# EAGLE schematic ee242a-lab4-amp -values2 (EAGLE 9.0.1)
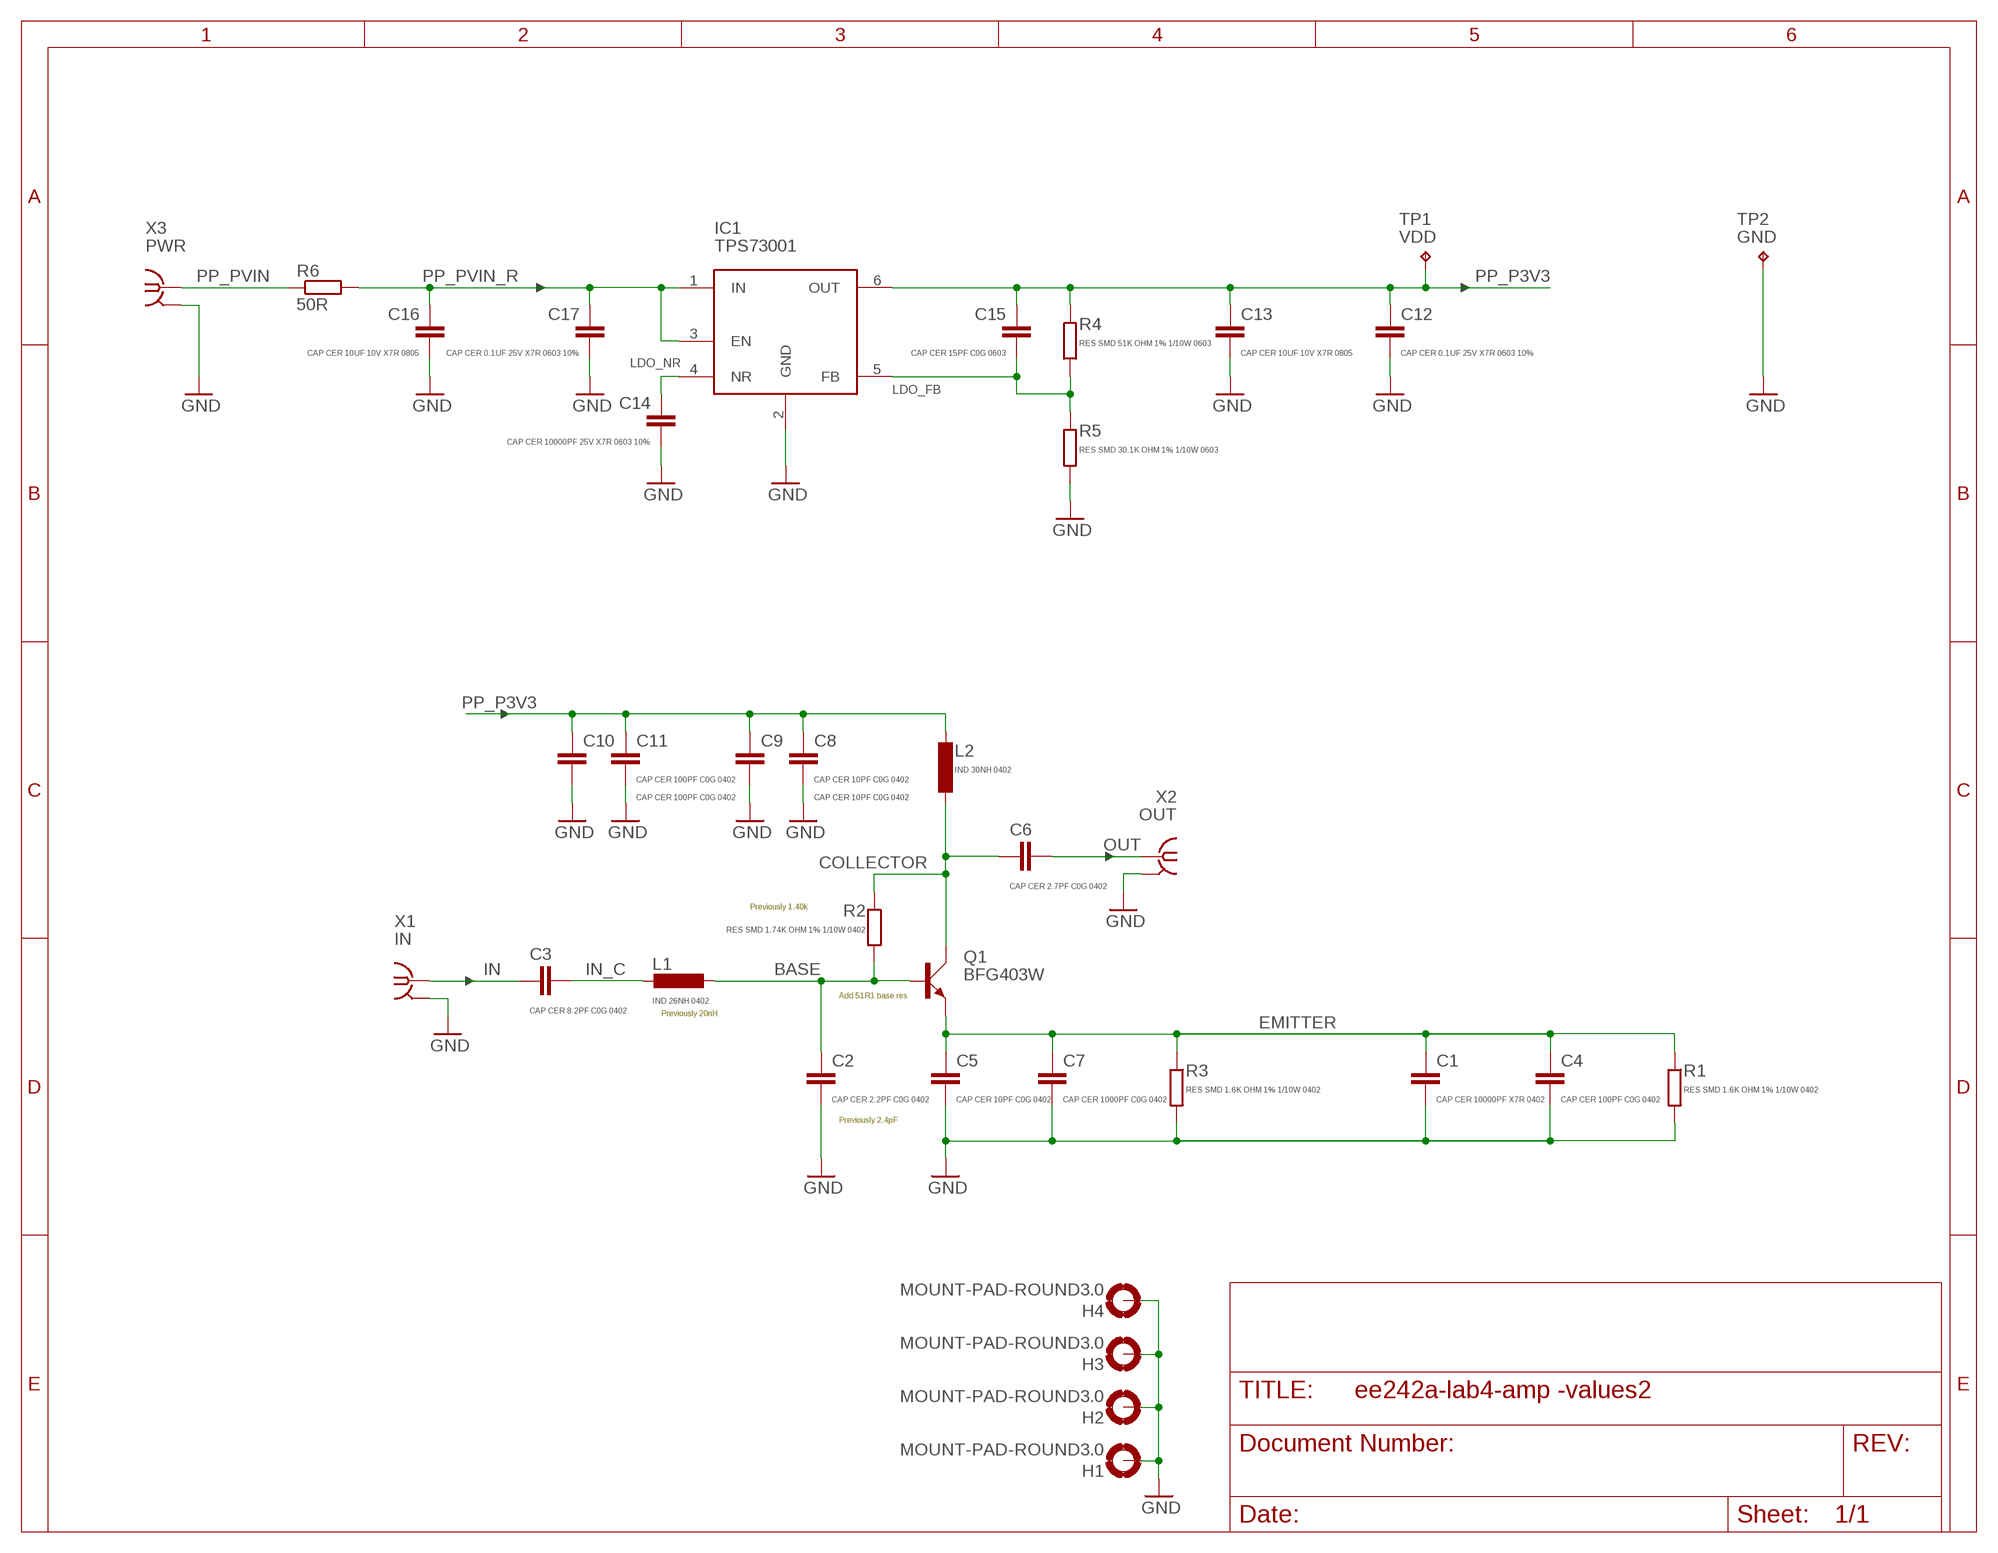
[diagram p0: schematic, sheet 1]

## Parts
C1  CAP CER 10000PF X7R 0402  C-EUC0402  [C0402]
C2  CAP CER 2.2PF C0G 0402  C-EUC0402  [C0402]
C3  CAP CER 8.2PF C0G 0402  C-EUC0402  [C0402]
C4  CAP CER 100PF C0G 0402  C-EUC0402  [C0402]
C5  CAP CER 10PF C0G 0402  C-EUC0402  [C0402]
C6  CAP CER 2.7PF C0G 0402  C-EUC0402  [C0402]
C7  CAP CER 1000PF C0G 0402  C-EUC0402  [C0402]
C8  CAP CER 10PF C0G 0402  C-EUC0402  [C0402]
C9  CAP CER 10PF C0G 0402  C-EUC0402  [C0402]
C10  CAP CER 100PF C0G 0402  C-EUC0402  [C0402]
C11  CAP CER 100PF C0G 0402  C-EUC0402  [C0402]
C12  CAP CER 0.1UF 25V X7R 0603 10%  C-EUC0603  [C0603]
C13  CAP CER 10UF 10V X7R 0805  C-EUC0805  [C0805]
C14  CAP CER 10000PF 25V X7R 0603 10%  C-EUC0603  [C0603]
C15  CAP CER 15PF C0G 0603  C-EUC0603  [C0603]
C16  CAP CER 10UF 10V X7R 0805  C-EUC0805  [C0805]
C17  CAP CER 0.1UF 25V X7R 0603 10%  C-EUC0603  [C0603]
H1  MOUNT-PAD-ROUND3.0  [3,0-PAD]
H2  MOUNT-PAD-ROUND3.0  [3,0-PAD]
H3  MOUNT-PAD-ROUND3.0  [3,0-PAD]
H4  MOUNT-PAD-ROUND3.0  [3,0-PAD]
IC1  TPS73001  [SOT23-6L]
L1  IND 26NH 0402  L-EU0402  [R0402]
L2  IND 30NH 0402  L-EU0402  [R0402]
Q1  BFG403W  [SOT343R]
R1  RES SMD 1.6K OHM 1% 1/10W 0402  R-EU_R0402  [R0402]
R2  RES SMD 1.74K OHM 1% 1/10W 0402  R-EU_R0402  [R0402]
R3  RES SMD 1.6K OHM 1% 1/10W 0402  R-EU_R0402  [R0402]
R4  RES SMD 51K OHM 1% 1/10W 0603  R-EU_R0603  [R0603]
R5  RES SMD 30.1K OHM 1% 1/10W 0603  R-EU_R0603  [R0603]
R6  50R  R-EU_R0805  [R0805]
TP1  VDD  KEYSTONE_5000  [KEYSTONE_5000_MINIATURE]
TP2  GND  KEYSTONE_5000  [KEYSTONE_5000_MINIATURE]
X1  IN  SMA-142-0701-881/886  [J502-ND-142-0701-881/886]
X2  OUT  SMA-142-0701-881/886  [J502-ND-142-0701-881/886]
X3  PWR  SMA-142-0701-881/886  [J502-ND-142-0701-881/886]

## Nets
BASE: C2.1 L1.2 Q1.2(B) R2.2
COLLECTOR: C6.1 L2.2 Q1.4(C) R2.1
EMITTER: C1.1 C4.1 C5.1 C7.1 Q1.1(E) Q1.3(E) R1.1 R3.1
GND: C1.2 C2.2 C4.2 C5.2 C7.2 C8.2 C9.2 C10.2 C11.2 C12.2 C13.2 C14.2 C16.2 C17.2 H1.B3,0(MOUNT) H2.B3,0(MOUNT) H3.B3,0(MOUNT) H4.B3,0(MOUNT) IC1.2(GND) R1.2 R3.2 R5.2 TP2.P$1 X1.G@1(GND) X2.G@1(GND) X3.G@1(GND)
IN: C3.1 X1.1
IN_C: C3.2 L1.1
LDO_FB: C15.2 IC1.5(FB) R4.1 R5.1
LDO_NR: C14.1 IC1.4(NR)
OUT: C6.2 X2.1
PP_P3V3: C8.1 C9.1 C10.1 C11.1 C12.1 C13.1 C15.1 IC1.6(OUT) L2.1 R4.2 TP1.P$1
PP_PVIN: R6.1 X3.1
PP_PVIN_R: C16.1 C17.1 IC1.1(IN) IC1.3(EN) R6.2

## Notes on the sheet
- Previously 1.40k
- Add 51R1 base res
- Previously 20nH
- Previously 2.4pF

## Power pins joined to a net without a drawn wire
GND: X1.G@2(GND) X1.G@3(GND) X1.G@4(GND) X2.G@2(GND) X2.G@3(GND) X2.G@4(GND) X3.G@2(GND) X3.G@3(GND) X3.G@4(GND)

## Library data of the parts
C1-C12 C14 C15 C17 = rcl-modified-footprints:C-EU: CAPACITOR, European symbol
C13 C16 = rcl:C-EU: CAPACITOR, European symbol
H1-H4 = holes:MOUNT-PAD-ROUND: MOUNTING PAD, round
IC1 = ee242a-lab-components:TPS73001
L1 L2 = rcl-modified-footprints:L-EU: INDUCTOR, European symbol
Q1 = ee242a-lab-components:BFG403W
R1-R6 = rcl-modified-footprints:R-EU_: RESISTOR, European symbol
TP1 TP2 = ee242a-lab-components:KEYSTONE_5000
X1-X3 = ee242a-lab-components:SMA-: SMA 50 Ohm End Launch Jack Receptacle - Round Contact Johnson Components Source: www.johnsoncomponents.com .. J502-ND.pdf; MF: JOHNSON COMPONENTS; MPN: 142-0701-881; OC_FARNELL: 1608603; OC_NEWARK: 08B906